# Altium schematic sheet Sheet1.SchDoc: LED Driver Module
size A; Author: Omar Fayed; DrawnBy: Omar Fayed; DocumentNumber: 1; Revision: A; SheetNumber: 1; SheetTotal: 1
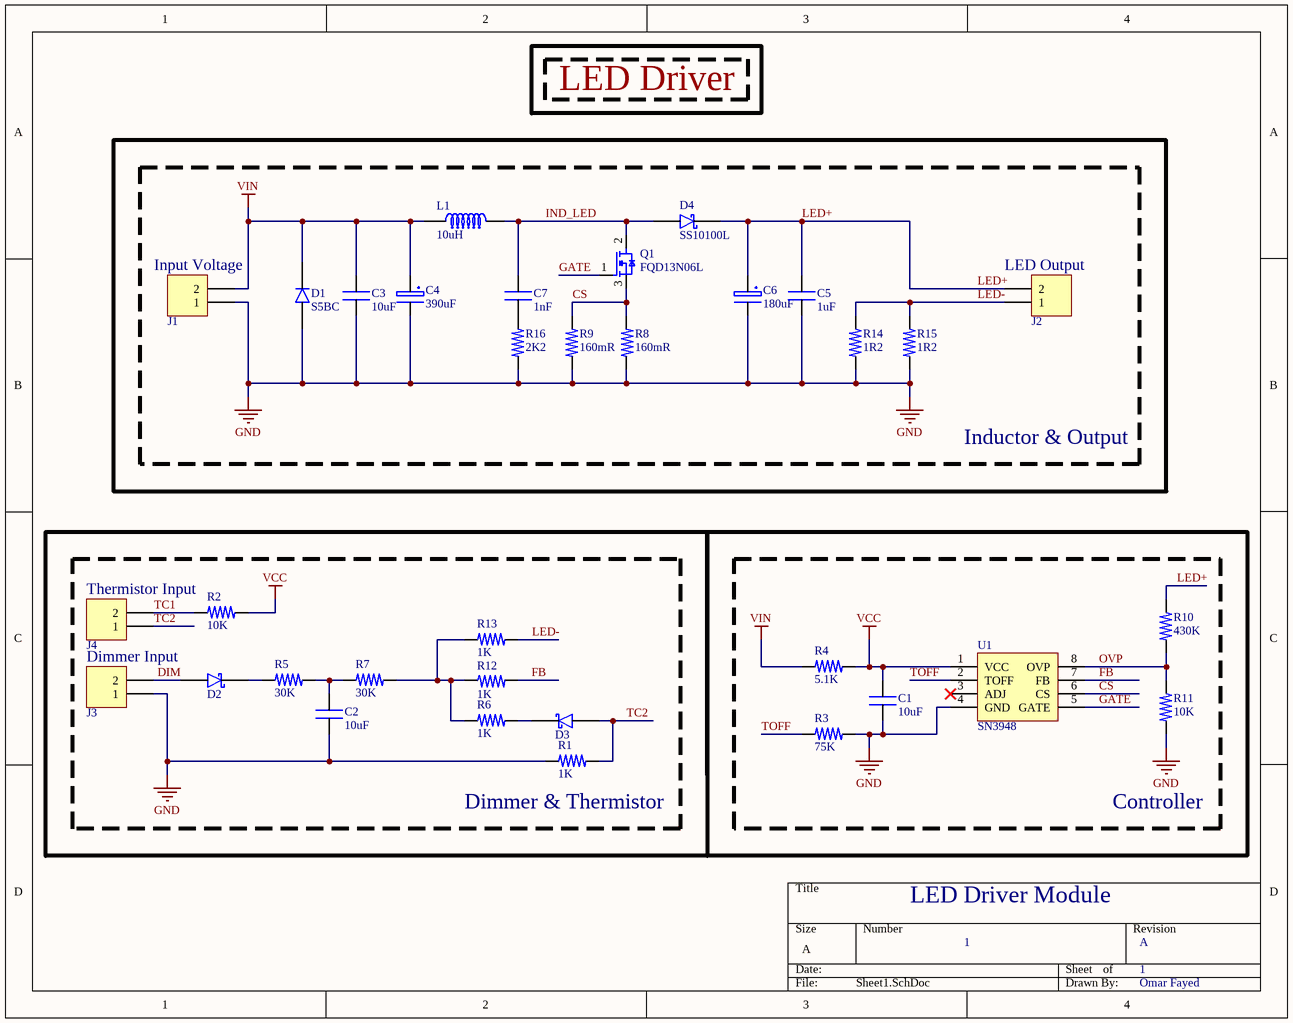
[diagram p0: Sheet1.SchDoc]

## Parts
C1  value 10uF  [CAP Ceramic SMD 0805]  (hidden comment: CAP SMD 0805 10uF 50V)
C2  value 10uF  [CAP Ceramic SMD 0805]  (hidden comment: CAP SMD 0805 10uF 50V)
C3  value 10uF  [CAP Ceramic SMD 0805]  (hidden comment: CAP SMD 0805 10uF 50V)
C4  390uF  [CAP Electrolytic TH D8C3.5H11.5 (H)]
C5  value 1uF  [CAP Ceramic SMD 1206]  (hidden comment: CAP SMD 1206 1uF 100V)
C6  180uF  [CAP Electrolytic TH D8C3.5H11.5 (H)]
C7  value 1nF  [CAP Ceramic SMD 0805]  (hidden comment: CAP SMD 0805 1nF)
D1  S5BC  [SMC]
D2  DIODE SMD BAT54WB  [SOD-323]  (value not drawn)
D3  DIODE SMD BAT54WB  [SOD-323]  (value not drawn)
D4  SS10100L  [DO-214AA]
J1  ScrewTerminal 2P mm  [Connector screw terminal Block TH 1x2 9.5 WJ46-B]  (value not drawn)
J2  ScrewTerminal 2P mm  [Connector screw terminal Block TH 1x2 9.5 WJ46-B]  (value not drawn)
J3  ScrewTerminal 2P mm  [Connector screw terminal Block TH 1x2 9.5 WJ46-B]  (value not drawn)
J4  ScrewTerminal 2P mm  [Connector screw terminal Block TH 1x2 9.5 WJ46-B]  (value not drawn)
L1  value 10uH  [IND SMD 1365]  (hidden comment: IND SMD 1365 10uH)
Q1  FQD13N06L  [TO252_2]
R1  1K  [RES SMD 0805]
R2  10K  [RES SMD 0805]
R3  75K  [RES SMD 0805]
R4  5.1K  [RES SMD 0805]
R5  30K  [RES SMD 0805]
R6  1K  [RES SMD 0805]
R7  30K  [RES SMD 0805]
R8  value 160mR  [RES SMD 1206]  (hidden comment: 16mR)
R9  value 160mR  [RES SMD 1206]  (hidden comment: 16mR)
R10  430K  [RES SMD 0805]
R11  10K  [RES SMD 0805]
R12  1K  [RES SMD 0805]
R13  1K  [RES SMD 0805]
R14  1R2  [RES SMD 1206]
R15  1R2  [RES SMD 1206]
R16  2K2  [RES SMD 0805]
U1  SN3948  [SN3948_SOP8]

## Blocks framed on the sheet
Inductor & Output: C3-C7 D1 D4 J1 J2 L1 Q1 R8 R9 R14-R16
Dimmer & Thermistor: C2 D2 D3 J3 J4 R1 R2 R5-R7 R12 R13
Controller: C1 R3 R4 R10 R11 U1

## Nets
GND: C1.1 C2.1 C3.1 C4.2 C5.1 C6.2 D1.1 J1.1 J3.1 R1.1 R3.2 R8.2 R9.1 R11.1 R14.1 R15.1 R16.1 U1.4(GND)
VCC: C1.2 R2.2 R4.2 U1.1(VCC)
VIN: C3.2 C4.1 D1.2 J1.2 L1.1 R4.1
CS: Q1.3(S) R8.1 R9.2 U1.6(CS)
DIM: D2.1 J3.2
FB: R12.1 U1.7(FB)
GATE: Q1.1(G) U1.5(GATE)
IND_LED: C7.2 D4.1 L1.2 Q1.2(D)
LED+: C5.2 C6.1 D4.2 J2.2 R10.2
LED-: J2.1 R13.2 R14.2 R15.2
OVP: R10.1 R11.2 U1.8(OVP)
TC1: J4.2 R2.1
TC2: D3.1 J4.1 R1.2
TOFF: R3.1 U1.2(TOFF)
NetC2_2: C2.2 R5.2 R7.1
NetC7_1: C7.1 R16.2
NetD2_2: D2.2 R5.1
NetD3_2: D3.2 R6.2
NetR6_1: R6.1 R7.2 R12.2 R13.1

Not connected (* = marked no-connect by the designer): U1 3(ADJ)*

## Notes on the sheet
- LED Driver
- (near J1) Input Voltage
- (near J2) LED Output
- Thermistor Input
- Dimmer Input

## Library data of the parts
C1-C3 = CAP SMD 0805 10uF 50V: 50V 10uF X5R ±10% 0805 Multilayer Ceramic Capacitors MLCC - SMD/SMT ROHS; Manufacturer: Murata Electronics; Manufacturer Part Number: GRM21BR61H106KE43L; Supplier: LCSC; Supplier Part Number: C440198
C4 = CAP POL 390uF 63V: Manufacturer: Ymin; Manufacturer Part Number: LKME2001J391MF; Supplier: LCSC; Supplier Part Number: C442948; Value: 390uF
C5 = CAP SMD 1206 1uF 100V: 100V 1uF X7R ±10% 1206 Multilayer Ceramic Capacitors MLCC - SMD/SMT ROHS; Manufacturer: YAGEO; Manufacturer Part Number: CC1206KKX7R0BB105; Supplier: LCSC; Supplier Part Number: C70463
C6 = CAP POL 180uF 50V: Manufacturer: SamYoung Electronics; Manufacturer Part Number: NXA50V180M8*20 LO; Supplier: LCSC; Supplier Part Number: C2835640; Value: 180uF
C7 = CAP SMD 0805 1nF: 100V 1nF NP0 ±5% 0805 Multilayer Ceramic Capacitors MLCC - SMD/SMT ROHS; Manufacturer: YAGEO; Manufacturer Part Number: CC0805JRNPO0BN102; Supplier: LCSC; Supplier Part Number: C326940
D1 = S5BC: 5A 100V 1.15V@5A SMC(DO-214AB) Diodes - General Purpose ROHS; Manufacturer: Diodes Incorporated; Manufacturer Part Number: S5BC-13-F; Supplier: LCSC; Supplier Part Number: C155211
D2 D3 = DIODE SMD BAT54WB: 30V 100mA 240mV@100mA SOD-323W Schottky Diodes ROHS /; Manufacturer: Shandong Jingdao Microelectronics; Manufacturer Part Number: BAT54WB; Supplier: LCSC; Supplier Part Number: C2972951
D4 = SS10100L: 100V 10A 700mV SMB Schottky Diodes ROHS; Manufacturer: GOODWORK; Manufacturer Part Number: SS10100L; Supplier: LCSC; Supplier Part Number: C21713964
J1-J4 = ScrewTerminal 2P mm: Copper Alloy 1x2P Tin 5mm 2.5 1 2 10A -40℃~+105℃ 300V Green 14~26 Direct Insert Plugin,P=5mm Screw Terminal Blocks ROHS; Manufacturer: MAX; Manufacturer Part Number: MX126-5.0-02P-GN01-Cu-S-A; Supplier: LCSC; ComponentLink1URL: https://datasheet.ciiva.com/824/6912141100xx-824001.pdf?src-supplier=Digi-Key; ComponentLink1Description: https://datasheet.ciiva.com/824/6912141100xx-824001.pdf?src-supplier=Digi-Key; ComponentLink2URL: https://datasheet.ciiva.com/48693/001088618-da-01-en-wr-tbl-terminal-block2141-691214110002-48693195.pdf?src-supplier=Conrad; ComponentLink2Description: https://datasheet.ciiva.com/48693/001088618-da-01-en-wr-tbl-terminal-block2141-691214110002-48693195.pdf?src-supplier=Conrad; Supplier Part Number: C5188434
L1 = IND SMD 1365 10uH: 10A 10uH ±20% 13A 19.2mΩ SMD,12.6x13.5mm Inductors (SMD) ROHS; Manufacturer: KOHERelec; Manufacturer Part Number: MDA1365-100M; Supllier Part Number: C2847583; Supplier: LCSC
Q1 = FQD13N06L: 60V 11A 115mΩ@10V,5.5A 2.5V@250uA 1 N-Channel TO-252AA MOSFETs ROHS; Manufacturer: onsemi; Manufacturer Part Number: FQD13N06LTM; Supplier: LCSC; Supplier Part Number: C236914
R1 R6 R12 R13 = RES SMD 0805 1K: Manufacturer: YAGEO; Manufacturer Part Number: RC0805FR-071KL; Supplier: LCSC; Supplier Part Number: C95781; Value: 1K
R2 R11 = RES SMD 0805 10K: 125mW Thick Film Resistors 150V ±100ppm/℃ ±1% 10kΩ 0805 Chip Resistor - Surface Mount ROHS; Manufacturer: YAGEO; Manufacturer Part Number: RC0805FR-0710KL; Supplier: LCSC; Supplier Part Number: C84376; Value: 10K
R3 = RES SMD 0805 75K: 125mW Thick Film Resistors 150V ±100ppm/℃ ±1% 75kΩ 0805 Chip Resistor - Surface Mount ROHS; Manufacturer: YAGEO; Manufacturer Part Number: RC0805FR-0775KL; Supplier: LCSC; Supplier Part Number: C137491; Value: 75K
R4 = RES SMD 0805 5.1K: 400mW Thick Film Resistors 150V ±200ppm/℃ ±5% 5.1kΩ 0805 Chip Resistor - Surface Mount ROHS; Manufacturer: ROHM Semicon; Manufacturer Part Number: ESR10EZPJ512; Supplier: LCSC; Supplier Part Number: C2085709; Value: 5.1K
R5 R7 = RES SMD 0805 30K: Manufacturer: FOJAN; Manufacturer Part Number: FRC0805J303TS; Supplier: LCSC; Supplier Part Number: C2930272; Value: 30K
R8 R9 = RES SMD 1206 160mR: 500mW Thick Film Resistors 200V ±1% 160mΩ 1206 Chip Resistor - Surface Mount ROHS; Manufacturer: UNI-ROYAL(Uniroyal Elec); Manufacturer Part Number: HP06W2F160LT5E; Supplier: LCSC; Supplier Part Number: C414953
R10 = RES SMD 0805 430K: 125mW Thick Film Resistors 150V ±100ppm/℃ ±5% 430kΩ 0805 Chip Resistor - Surface Mount ROHS; Manufacturer: YAGEO; Manufacturer Part Number: RC0805JR-07430KL; Supplier: LCSC; Supplier Part Number: C137431; Value: 430K
R14 R15 = RES SMD 1206 1R20: 500mW Thick Film Resistors ±200ppm/℃ ±1% 1.2Ω 1206 Chip Resistor - Surface Mount ROHS; Manufacturer: YAGEO; Manufacturer Part Number: RC1206FR-7W1R2L; Supplier: LCSC; Supplier Part Number: C5355180; Value: 1R2
R16 = RES SMD 0805 2K2: Manufacturer: YAGEO; Manufacturer Part Number: RC0805FR-072K2L; Supplier: LCSC; Supplier Part Number: C114561; Value: 2K2
U1 = SN3948: SOP-8 DC-DC Converters ROHS; Manufacturer: ISSI; Manufacturer Part Number: SN3948; Supplier: LCSC; Supplier Part Number: C3041112